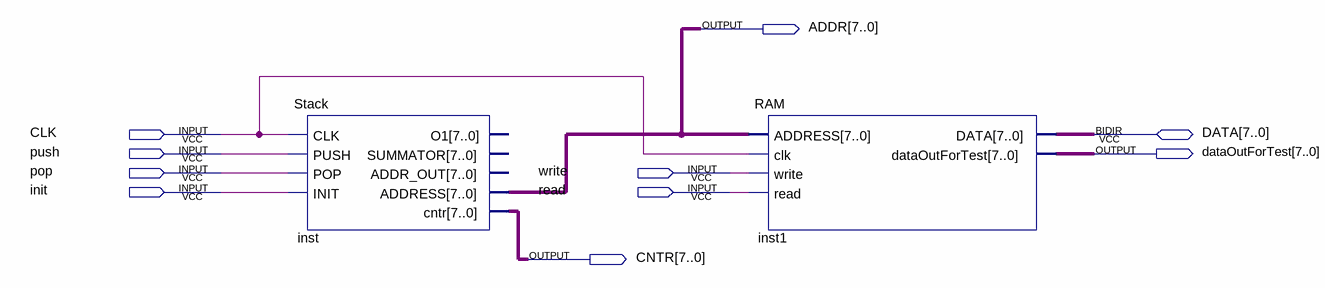
[diagram p0: schematic sheet]
// Quartus schematic test.bdf as structural Verilog: 2 symbols, 10 pins
module test (
  input  CLK,
  input  push,
  input  pop,
  input  write,
  input  init,
  input  read,
  inout  [7:0] DATA,
  output [7:0] ADDR,
  output [7:0] dataOutForTest,
  output [7:0] CNTR
);

  Stack inst (
    .CLK(CLK), .PUSH(push), .POP(pop), .INIT(init), .ADDRESS(ADDR), .cntr(CNTR));  // open: O1, SUMMATOR, ADDR_OUT
  RAM inst1 (.ADDRESS(ADDR), .clk(CLK), .write(write), .read(read), .dataOutForTest(dataOutForTest), .DATA(DATA));
endmodule
